# Altium schematic sheet Power Diagram.SchDoc
size A4; SheetNumber: 3; SheetTotal: 4
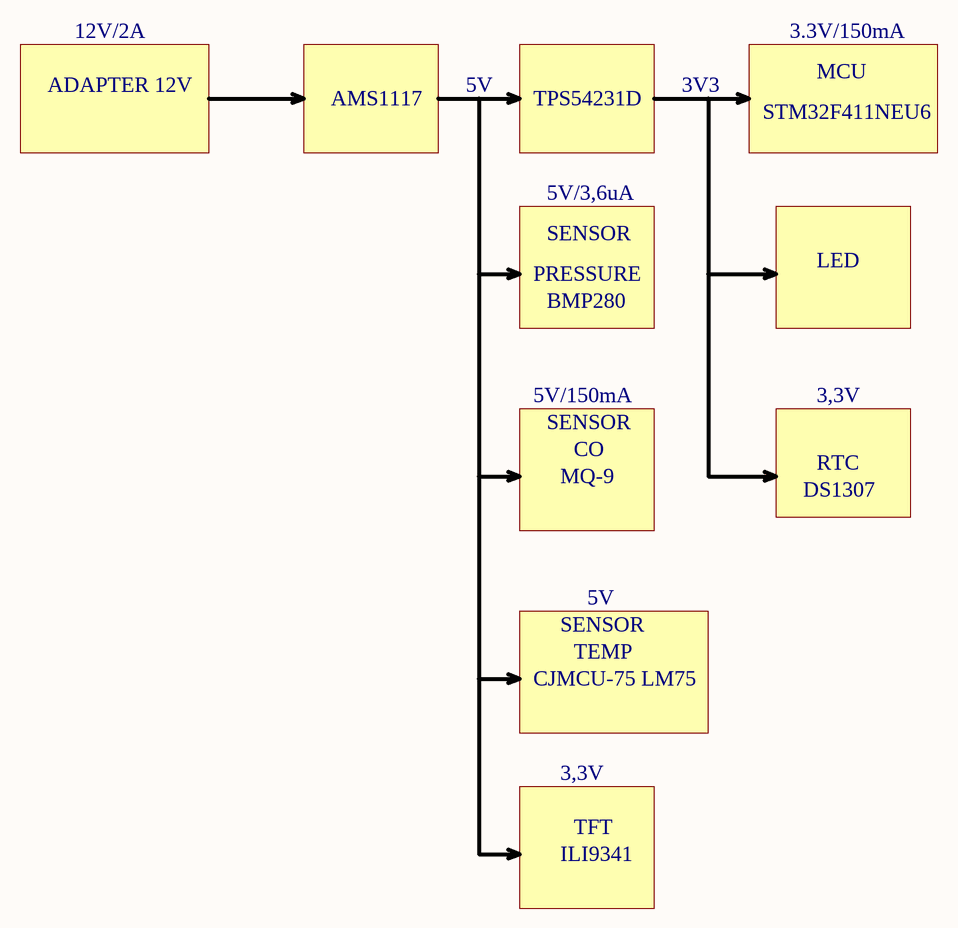
[diagram p0: Power Diagram.SchDoc]

## Notes on the sheet
- ADAPTER 12V
- 12V/2A
- 5V
- 3V3
- 3.3V/150mA
- MCU
- AMS1117
- TPS54231D
- STM32F411NEU6
- 5V/3,6uA
- PRESSURE
- SENSOR
- LED
- BMP280
- 5V/150mA
- 3,3V
- MQ-9
- CO
- DS1307
- RTC
- CJMCU-75 LM75
- TEMP
- TFT
- ILI9341